# EAGLE design TempSensor (EAGLE 7.2.0)
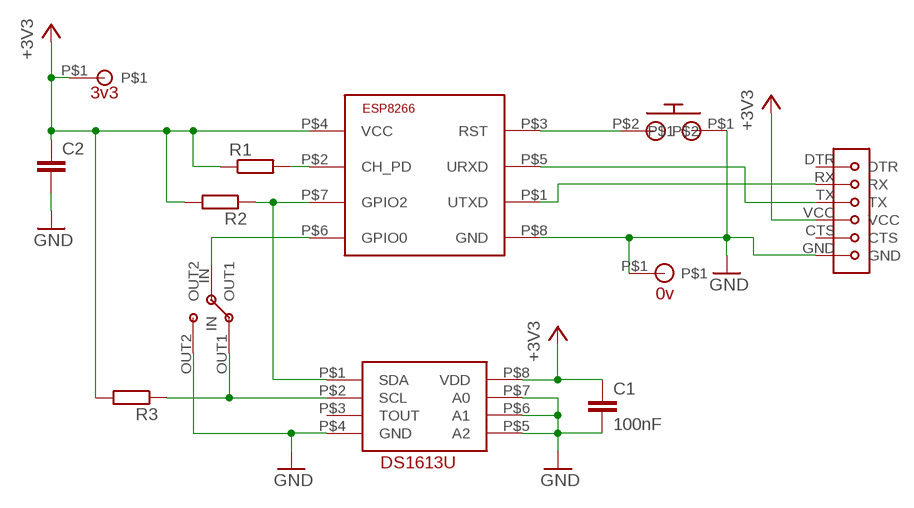
[diagram p0: schematic, sheet 1]

## Parts
C1  100nF  C-EU025-025X050  [C025-025X050]
C2  C-EU025-025X050  [C025-025X050]
R1  R-EU_0207/10  [0207/10]
R2  R-EU_0207/10  [0207/10]
R3  R-EU_0207/10  [0207/10]
U$1  ESP8266-01  [ESP-01]
U$2  TACT-SWITCH  [TACT-SWITCH]
U$3  DS1631U-BREAKOUT  [DS1631U-BREAKOUT]
U$4  SPDT-SWITCH-1  [SPDT-SWITCH-1]
U$5  FT232RL-ADAPTER  [FT232RL-ADAPTER]
U$6  3V3  [3V3]
U$7  0V  [0V]

## Nets
+3V3: C1.1 C2.1 R1.1 R2.2 R3.2 U$1.P$4(VCC) U$3.P$8(VDD) U$5.VCC U$6.P$1
GND: C1.2 C2.2 U$1.P$8(GND) U$2.P$1 U$3.P$4(GND) U$3.P$5(A2) U$3.P$6(A1) U$3.P$7(A0) U$4.OUT2 U$5.GND U$7.P$1
N$1: U$1.P$6(GPIO0) U$4.IN
N$2: U$1.P$3(RST) U$2.P$2
N$3: R3.1 U$3.P$2(SCL) U$4.OUT1
N$4: R2.1 U$1.P$7(GPIO2) U$3.P$1(SDA)
N$5: U$1.P$5(URXD) U$5.TX
N$6: U$1.P$1(UTXD) U$5.RX
N$8: R1.2 U$1.P$2(CH_PD)
Unconnected: U$3.P$3(TOUT) U$5.CTS U$5.DTR

## Library data of the parts
C1 C2 = rcl:C-EU: CAPACITOR, European symbol
R1-R3 = rcl:R-EU_: RESISTOR, European symbol
U$1 = ESP8266:ESP8266-01: ESP8266 - ESP-01 Module
U$2 = Buttons:TACT-SWITCH
U$3 = ICs:DS1631U-BREAKOUT
U$4 = Buttons:SPDT-SWITCH-1
U$5 = ICs:FT232RL-ADAPTER
U$6 = Power:3V3
U$7 = Power:0V

## Board
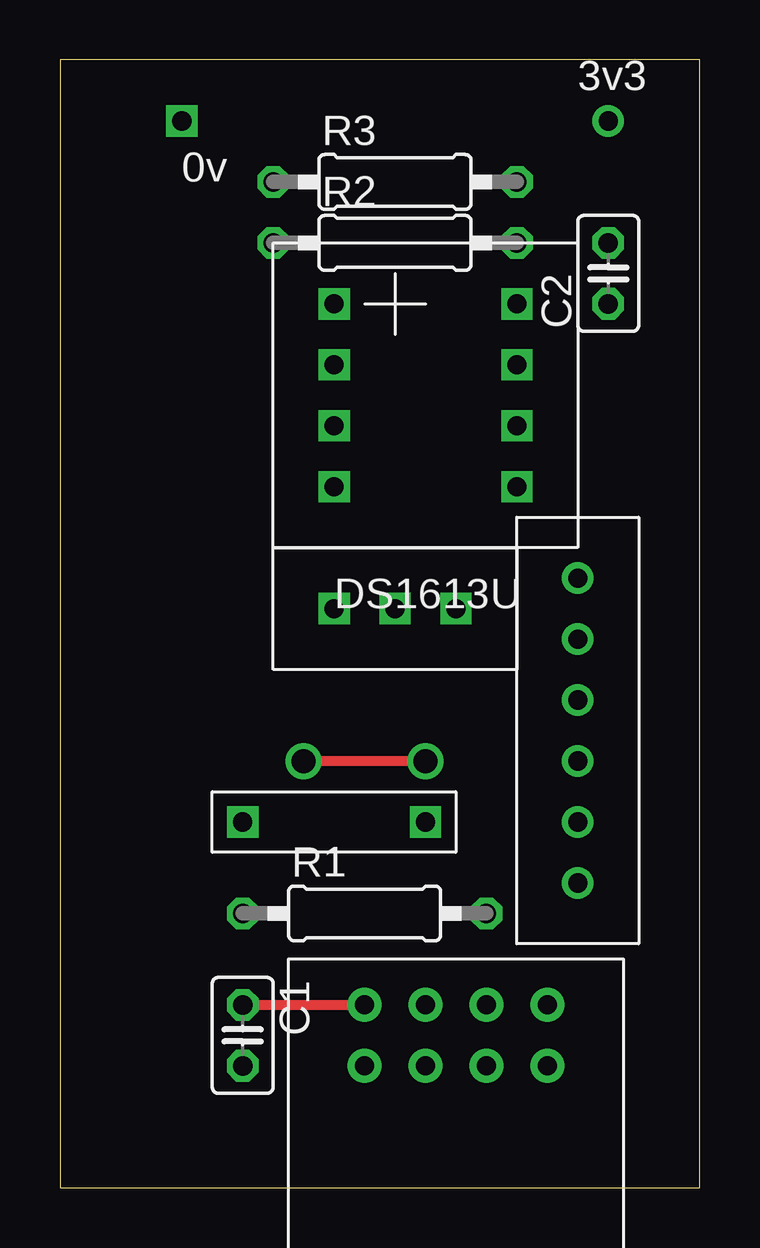
[diagram p1: board, top side]
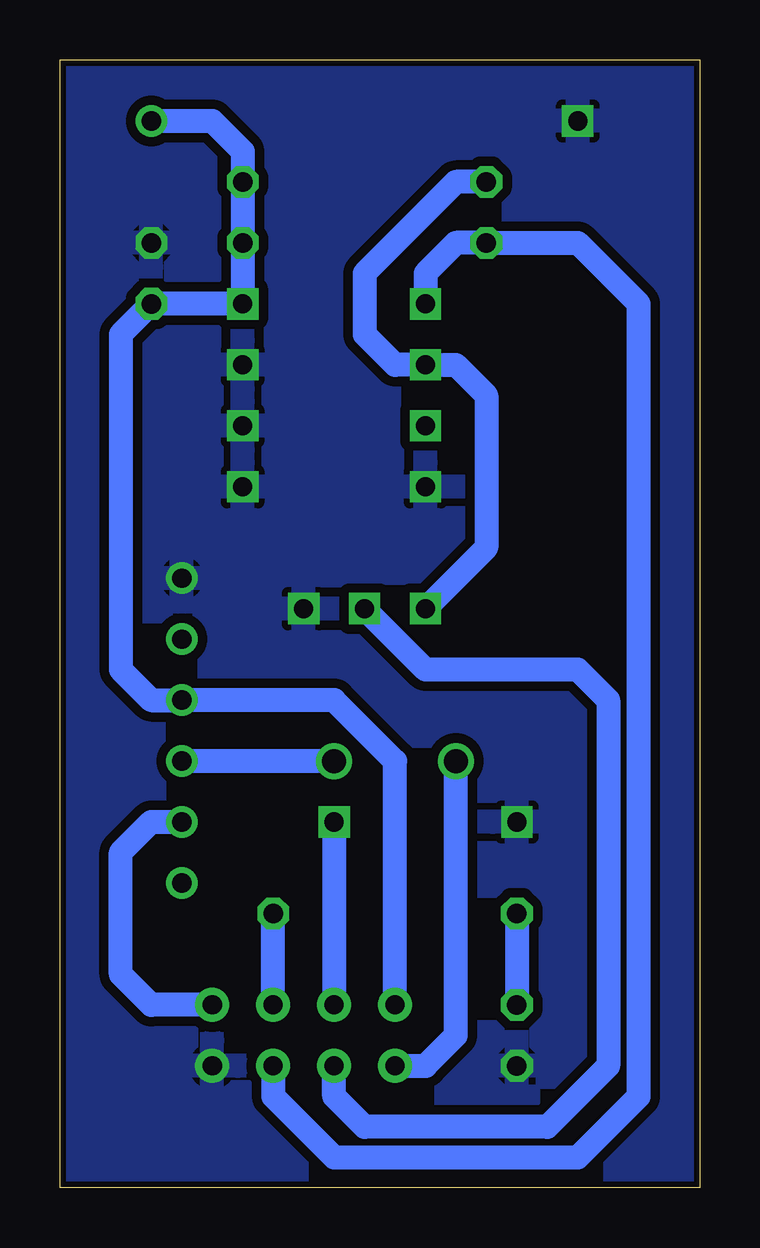
[diagram p2: board, bottom side, seen from below]

Size 26.67 x 46.99 mm. Coordinates in mm from the lower left corner, seen from the top.
Outline: 0,0 26.67,0 26.67,46.99 0,46.99 0,0
Copper layers (1*16): Top 0.035mm / dielectric 1.5mm / Bottom 0.035mm
Design rules "default *": minimum track width 1mm, minimum drill 3mm, track to track 0.4mm, track to pad 0.4mm, pad to pad 0.4mm, via to via 0.4mm, smd to smd 0.4mm, copper to edge 10mil, drill to drill 8mil, minimum pad ring 10mil, minimum via ring 8mil, stop-mask expansion 4mil, vias tented up to drill 0mil, thermal gap 10mil

### Footprints (pad centres in the part's own frame; a part is rotated, then mirrored left to right if it is on the bottom)
C025-025X050 = drill 0.813 octagon: 1 -1.27,0; 2 1.27,0
0207/10 = drill 0.813 octagon: 1 -5.08,0; 2 5.08,0
ESP-01 = drill 0.8 pad 1.422: P$1 0,0; P$2 2.54,0; P$3 5.08,0; P$4 7.62,0; P$5 7.62,2.54; P$6 5.08,2.54; P$7 2.54,2.54; P$8 0,2.54
TACT-SWITCH = drill 0.8 square: P$1 -5.08,0; P$2 2.54,0
DS1631U-BREAKOUT = drill 0.8 square: P$1 -5.08,2.54; P$2 -5.08,0; P$3 -5.08,-2.54; P$4 -5.08,-5.08; P$5 2.54,-5.08; P$6 2.54,-2.54; P$7 2.54,0; P$8 2.54,2.54
SPDT-SWITCH-1 = drill 0.8 square: IN 0,0; OUT1 -2.54,0; OUT2 2.54,0
FT232RL-ADAPTER = drill 0.8: CTS 0,0; DTR -10.16,0; GND 2.54,0; RX -7.62,0; TX -5.08,0; VCC -2.54,0
3V3 = drill 0.8: P$1 0,0
0V = drill 0.8 square: P$1 0,0

### Placement (x,y rotation side)
C1  7.62,6.35 270 top
C2  22.86,38.1 90 top
R1  12.7,11.43 0 top
R2  13.97,39.37 0 top
R3  13.97,41.91 0 top
U$1  20.32,7.62 180 top
U$2  12.7,15.24 0 top
U$3  16.51,34.29 0 top
U$4  13.97,24.13 0 top
U$5  21.59,22.86 90 top
U$6  22.86,44.45 0 top
U$7  5.08,44.45 0 top

### Tracks (layer width: path | path; a pad name or v marks a point on that pad's centre or on a via)
+3V3
  Top 0.406: C1.1 U$1.P$4
  Bottom 1: R1.1 C1.1 | U$1.P$4 12.7,17.78 15.24,20.32 U$5.VCC 22.86,20.32 24.13,21.59 24.13,35.56 C2.1 U$3.P$8 R2.2 R3.2 19.05,43.18 20.32,44.45 U$6.P$1
GND
  pour Bottom: 0,46.99 26.67,46.99 26.67,0 0,0
N$1
  Bottom 1: U$1.P$6 15.24,3.81 13.97,2.54 6.35,2.54 3.81,5.08 3.81,20.32 5.08,21.59 11.43,21.59 U$4.IN
N$2
  Bottom 1: U$2.P$2 U$1.P$3
N$3
  Bottom 1: R3.1 10.16,41.91 13.97,38.1 13.97,35.56 12.7,34.29 U$3.P$2 10.16,34.29 8.89,33.02 8.89,26.67 U$4.OUT1
N$4
  Bottom 1: U$1.P$7 17.78,3.81 15.24,1.27 5.08,1.27 2.54,3.81 2.54,36.83 5.08,39.37 R2.1 10.16,39.37 11.43,38.1 U$3.P$1
N$5  (via drill 1)
  Top 0.406: v15.24,17.78 v10.16,17.78
  Bottom 1: U$1.P$5 11.43,5.08 10.16,6.35 v10.16,17.78 | v15.24,17.78 U$5.TX
N$6
  Bottom 1: U$1.P$1 22.86,7.62 24.13,8.89 24.13,13.97 22.86,15.24 U$5.RX
N$8
  Bottom 1: U$1.P$2 R1.2